# EAGLE schematic W952 (EAGLE 6.6.0)
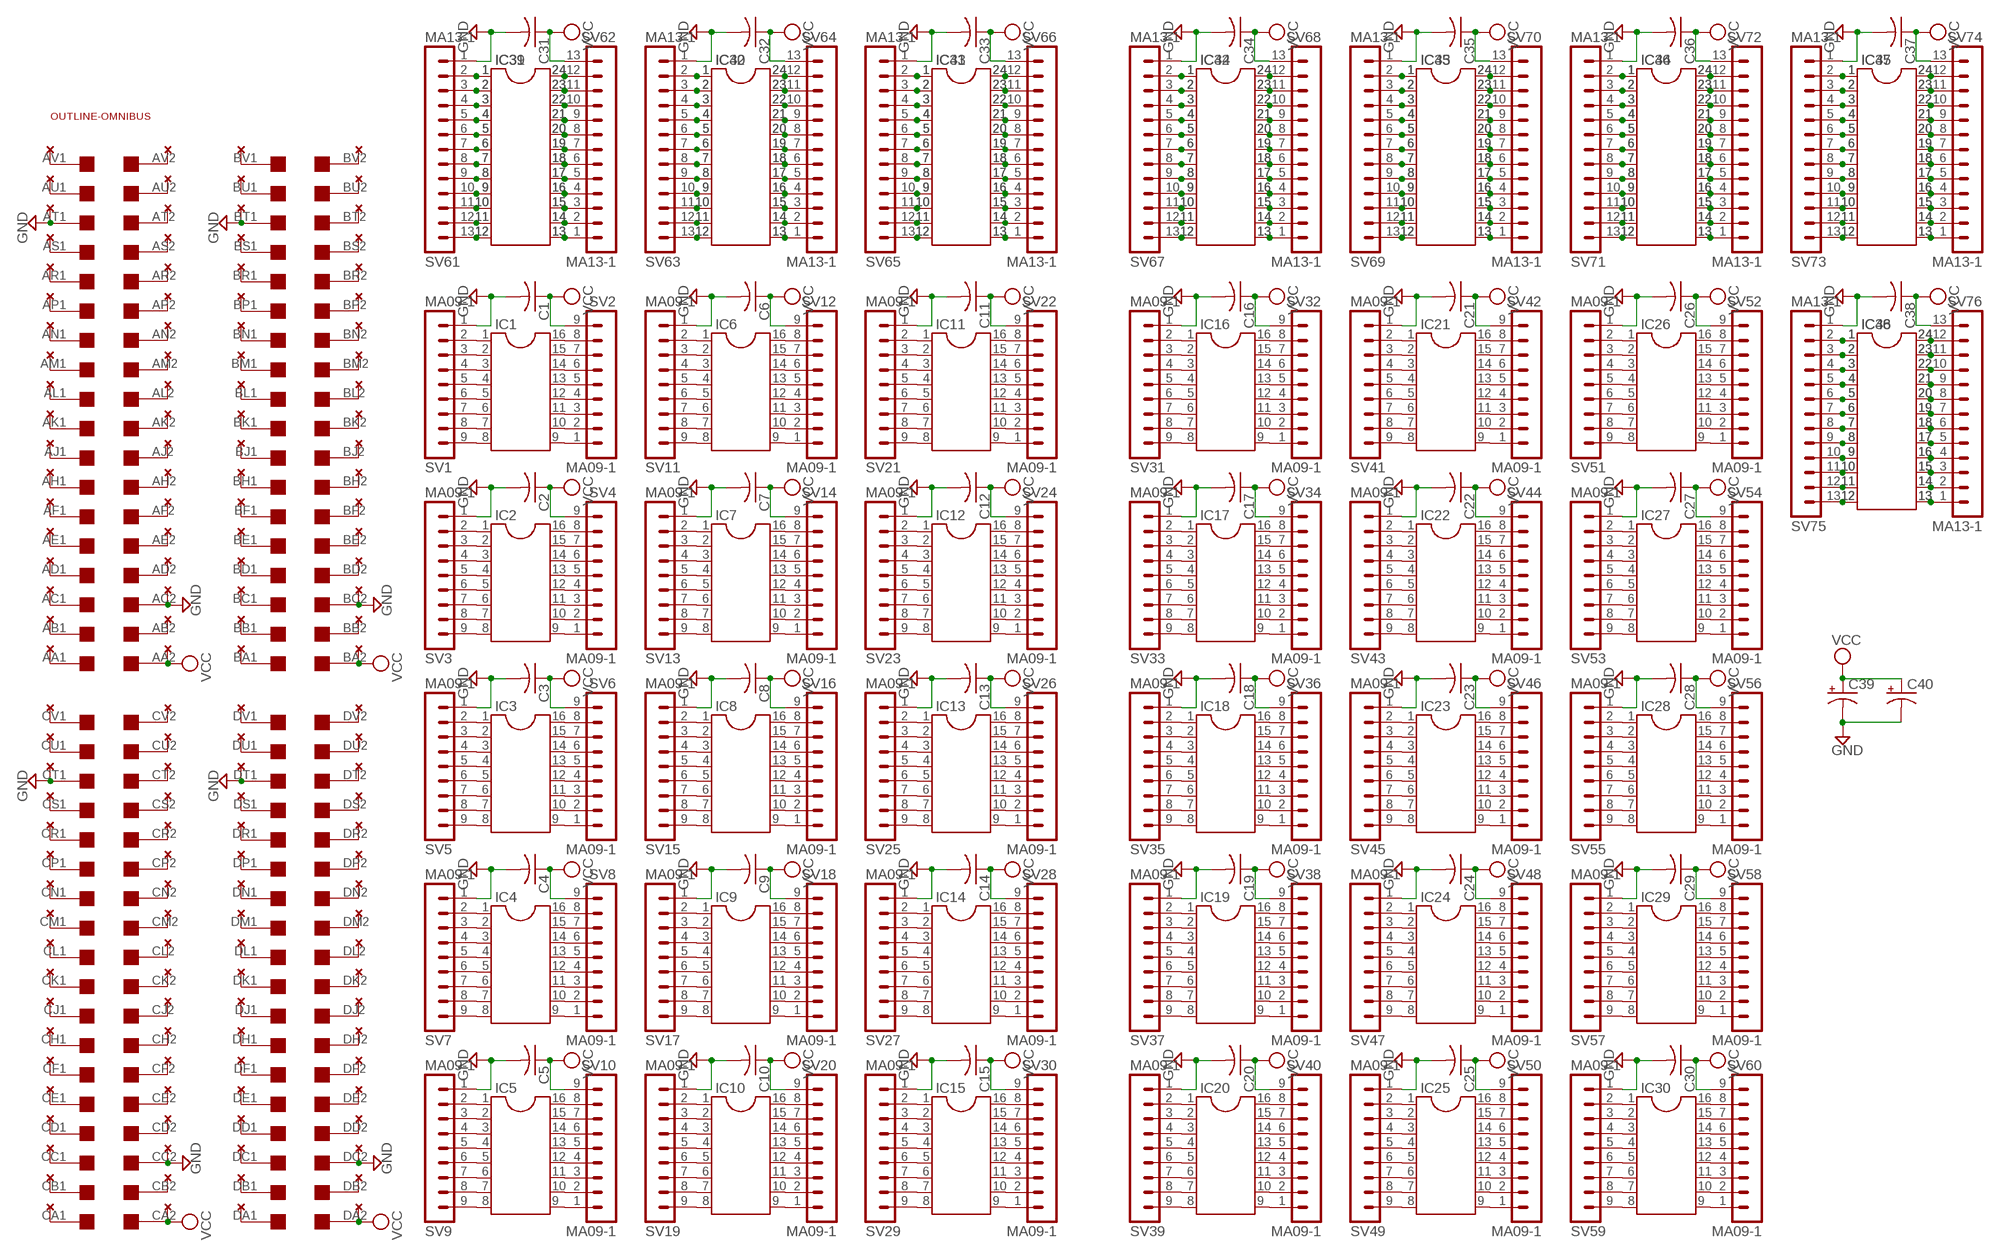
[diagram p0: schematic, sheet 1]

## Parts
C1  C-US075-032X103  [C075-032X103]
C2  C-US075-032X103  [C075-032X103]
C3  C-US075-032X103  [C075-032X103]
C4  C-US075-032X103  [C075-032X103]
C5  C-US075-032X103  [C075-032X103]
C6  C-US075-032X103  [C075-032X103]
C7  C-US075-032X103  [C075-032X103]
C8  C-US075-032X103  [C075-032X103]
C9  C-US075-032X103  [C075-032X103]
C10  C-US075-032X103  [C075-032X103]
C11  C-US075-032X103  [C075-032X103]
C12  C-US075-032X103  [C075-032X103]
C13  C-US075-032X103  [C075-032X103]
C14  C-US075-032X103  [C075-032X103]
C15  C-US075-032X103  [C075-032X103]
C16  C-US075-032X103  [C075-032X103]
C17  C-US075-032X103  [C075-032X103]
C18  C-US075-032X103  [C075-032X103]
C19  C-US075-032X103  [C075-032X103]
C20  C-US075-032X103  [C075-032X103]
C21  C-US075-032X103  [C075-032X103]
C22  C-US075-032X103  [C075-032X103]
C23  C-US075-032X103  [C075-032X103]
C24  C-US075-032X103  [C075-032X103]
C25  C-US075-032X103  [C075-032X103]
C26  C-US075-032X103  [C075-032X103]
C27  C-US075-032X103  [C075-032X103]
C28  C-US075-032X103  [C075-032X103]
C29  C-US075-032X103  [C075-032X103]
C30  C-US075-032X103  [C075-032X103]
C31  C-US075-032X103  [C075-032X103]
C32  C-US075-032X103  [C075-032X103]
C33  C-US075-032X103  [C075-032X103]
C34  C-US075-032X103  [C075-032X103]
C35  C-US075-032X103  [C075-032X103]
C36  C-US075-032X103  [C075-032X103]
C37  C-US075-032X103  [C075-032X103]
C38  C-US075-032X103  [C075-032X103]
C39  CPOL-USE15-5AXIAL  [E15-5]
C40  CPOL-USE15-5AXIAL  [E15-5]
IC1  DIL16S  [SOCKET-16]
IC2  DIL16S  [SOCKET-16]
IC3  DIL16S  [SOCKET-16]
IC4  DIL16S  [SOCKET-16]
IC5  DIL16S  [SOCKET-16]
IC6  DIL16S  [SOCKET-16]
IC7  DIL16S  [SOCKET-16]
IC8  DIL16S  [SOCKET-16]
IC9  DIL16S  [SOCKET-16]
IC10  DIL16S  [SOCKET-16]
IC11  DIL16S  [SOCKET-16]
IC12  DIL16S  [SOCKET-16]
IC13  DIL16S  [SOCKET-16]
IC14  DIL16S  [SOCKET-16]
IC15  DIL16S  [SOCKET-16]
IC16  DIL16S  [SOCKET-16]
IC17  DIL16S  [SOCKET-16]
IC18  DIL16S  [SOCKET-16]
IC19  DIL16S  [SOCKET-16]
IC20  DIL16S  [SOCKET-16]
IC21  DIL16S  [SOCKET-16]
IC22  DIL16S  [SOCKET-16]
IC23  DIL16S  [SOCKET-16]
IC24  DIL16S  [SOCKET-16]
IC25  DIL16S  [SOCKET-16]
IC26  DIL16S  [SOCKET-16]
IC27  DIL16S  [SOCKET-16]
IC28  DIL16S  [SOCKET-16]
IC29  DIL16S  [SOCKET-16]
IC30  DIL16S  [SOCKET-16]
IC31  DIL24-6  [DIL24-6]
IC32  DIL24-6  [DIL24-6]
IC33  DIL24-6  [DIL24-6]
IC34  DIL24-6  [DIL24-6]
IC35  DIL24-6  [DIL24-6]
IC36  DIL24-6  [DIL24-6]
IC37  DIL24-6  [DIL24-6]
IC38  DIL24-6  [DIL24-6]
IC39  DIL24-3  [DIL24-3]
IC40  DIL24-3  [DIL24-3]
IC41  DIL24-3  [DIL24-3]
IC42  DIL24-3  [DIL24-3]
IC43  DIL24-3  [DIL24-3]
IC44  DIL24-3  [DIL24-3]
IC45  DIL24-3  [DIL24-3]
IC46  DIL24-3  [DIL24-3]
SV1  MA09-1  [MA09-1]
SV2  MA09-1  [MA09-1]
SV3  MA09-1  [MA09-1]
SV4  MA09-1  [MA09-1]
SV5  MA09-1  [MA09-1]
SV6  MA09-1  [MA09-1]
SV7  MA09-1  [MA09-1]
SV8  MA09-1  [MA09-1]
SV9  MA09-1  [MA09-1]
SV10  MA09-1  [MA09-1]
SV11  MA09-1  [MA09-1]
SV12  MA09-1  [MA09-1]
SV13  MA09-1  [MA09-1]
SV14  MA09-1  [MA09-1]
SV15  MA09-1  [MA09-1]
SV16  MA09-1  [MA09-1]
SV17  MA09-1  [MA09-1]
SV18  MA09-1  [MA09-1]
SV19  MA09-1  [MA09-1]
SV20  MA09-1  [MA09-1]
SV21  MA09-1  [MA09-1]
SV22  MA09-1  [MA09-1]
SV23  MA09-1  [MA09-1]
SV24  MA09-1  [MA09-1]
SV25  MA09-1  [MA09-1]
SV26  MA09-1  [MA09-1]
SV27  MA09-1  [MA09-1]
SV28  MA09-1  [MA09-1]
SV29  MA09-1  [MA09-1]
SV30  MA09-1  [MA09-1]
SV31  MA09-1  [MA09-1]
SV32  MA09-1  [MA09-1]
SV33  MA09-1  [MA09-1]
SV34  MA09-1  [MA09-1]
SV35  MA09-1  [MA09-1]
SV36  MA09-1  [MA09-1]
SV37  MA09-1  [MA09-1]
SV38  MA09-1  [MA09-1]
SV39  MA09-1  [MA09-1]
SV40  MA09-1  [MA09-1]
SV41  MA09-1  [MA09-1]
SV42  MA09-1  [MA09-1]
SV43  MA09-1  [MA09-1]
SV44  MA09-1  [MA09-1]
SV45  MA09-1  [MA09-1]
SV46  MA09-1  [MA09-1]
SV47  MA09-1  [MA09-1]
SV48  MA09-1  [MA09-1]
SV49  MA09-1  [MA09-1]
SV50  MA09-1  [MA09-1]
SV51  MA09-1  [MA09-1]
SV52  MA09-1  [MA09-1]
SV53  MA09-1  [MA09-1]
SV54  MA09-1  [MA09-1]
SV55  MA09-1  [MA09-1]
SV56  MA09-1  [MA09-1]
SV57  MA09-1  [MA09-1]
SV58  MA09-1  [MA09-1]
SV59  MA09-1  [MA09-1]
SV60  MA09-1  [MA09-1]
SV61  MA13-1  [MA13-1]
SV62  MA13-1  [MA13-1]
SV63  MA13-1  [MA13-1]
SV64  MA13-1  [MA13-1]
SV65  MA13-1  [MA13-1]
SV66  MA13-1  [MA13-1]
SV67  MA13-1  [MA13-1]
SV68  MA13-1  [MA13-1]
SV69  MA13-1  [MA13-1]
SV70  MA13-1  [MA13-1]
SV71  MA13-1  [MA13-1]
SV72  MA13-1  [MA13-1]
SV73  MA13-1  [MA13-1]
SV74  MA13-1  [MA13-1]
SV75  MA13-1  [MA13-1]
SV76  MA13-1  [MA13-1]
U$1  QUAD  [EDGE-CON8]
U$2  THRU-HOLE2W  [THRU-HOLE2]
U$3  THRU-HOLE2W  [THRU-HOLE2]
U$4  THRU-HOLE2W  [THRU-HOLE2]
U$5  THRU-HOLE2W  [THRU-HOLE2]
U$8  OUTLINE-OMNIBUS  [OMNIBUS]

## Nets
GND [supply]: C1.2 C2.2 C3.2 C4.2 C5.2 C6.2 C7.2 C8.2 C9.2 C10.2 C11.2 C12.2 C13.2 C14.2 C15.2 C16.2 C17.2 C18.2 C19.2 C20.2 C21.2 C22.2 C23.2 C24.2 C25.2 C26.2 C27.2 C28.2 C29.2 C30.2 C31.2 C32.2 C33.2 C34.2 C35.2 C36.2 C37.2 C38.2 C39.- C40.- SV1.1 SV3.1 SV5.1 SV7.1 SV9.1 SV11.1 SV13.1 SV15.1 SV17.1 SV19.1 SV21.1 SV23.1 SV25.1 SV27.1 SV29.1 SV31.1 SV33.1 SV35.1 SV37.1 SV39.1 SV41.1 SV43.1 SV45.1 SV47.1 SV49.1 SV51.1 SV53.1 SV55.1 SV57.1 SV59.1 SV61.1 SV63.1 SV65.1 SV67.1 SV69.1 SV71.1 SV73.1 SV75.1 U$1.AC2 U$1.AT1 U$1.BC2 U$1.BT1 U$1.CC2 U$1.CT1 U$1.DC2 U$1.DT1 U$2.C1 U$2.T2 U$3.C1 U$3.T2 U$4.C1 U$4.T2 U$5.C1 U$5.T2
N$1: U$1.AK1 U$2.K2
N$2: U$1.AJ1 U$2.J2
N$3: U$1.AH1 U$2.H2
N$4: U$1.AL1 U$2.L2
N$5: U$1.AM1 U$2.M2
N$6: U$1.AN1 U$2.N2
N$7: U$1.AP1 U$2.P2
N$8: U$1.AF1 U$2.F2
N$9: U$1.AE1 U$2.E2
N$10: U$1.AD1 U$2.D2
N$11: U$1.AC1 U$2.C2
N$12: U$1.AR1 U$2.R2
N$13: U$1.AS1 U$2.S2
N$14: U$1.AB1 U$2.B2
N$15: U$1.AA1 U$2.A2
N$16: U$1.AU1 U$2.U2
N$17: U$1.AV1 U$2.V2
N$18: U$1.AV2 U$2.V1
N$19: U$1.AU2 U$2.U1
N$20: U$1.AT2 U$2.T1
N$21: U$1.AS2 U$2.S1
N$22: U$1.AR2 U$2.R1
N$23: U$1.AP2 U$2.P1
N$24: U$1.AN2 U$2.N1
N$25: U$1.AM2 U$2.M1
N$26: U$1.AL2 U$2.L1
N$27: U$1.AK2 U$2.K1
N$28: U$1.AJ2 U$2.J1
N$29: U$1.AH2 U$2.H1
N$30: U$1.AF2 U$2.F1
N$31: U$1.AE2 U$2.E1
N$32: U$1.AD2 U$2.D1
N$33: U$1.AB2 U$2.B1
N$34: U$1.BV1 U$3.V2
N$35: U$1.BU1 U$3.U2
N$36: U$1.BS1 U$3.S2
N$37: U$1.BR1 U$3.R2
N$38: U$1.BP1 U$3.P2
N$39: U$1.BN1 U$3.N2
N$40: U$1.BM1 U$3.M2
N$41: U$1.BL1 U$3.L2
N$42: U$1.BK1 U$3.K2
N$43: U$1.BJ1 U$3.J2
N$44: U$1.BH1 U$3.H2
N$45: U$1.BF1 U$3.F2
N$46: U$1.BE1 U$3.E2
N$47: U$1.BD1 U$3.D2
N$48: U$1.BC1 U$3.C2
N$49: U$1.BB1 U$3.B2
N$50: U$1.BA1 U$3.A2
N$51: U$1.BV2 U$3.V1
N$52: U$1.BU2 U$3.U1
N$53: U$1.BT2 U$3.T1
N$54: U$1.BS2 U$3.S1
N$55: U$1.BR2 U$3.R1
N$56: U$1.BP2 U$3.P1
N$57: U$1.BN2 U$3.N1
N$58: U$1.BM2 U$3.M1
N$59: U$1.BL2 U$3.L1
N$60: U$1.BK2 U$3.K1
N$61: U$1.BJ2 U$3.J1
N$62: U$1.BH2 U$3.H1
N$63: U$1.BF2 U$3.F1
N$64: U$1.BE2 U$3.E1
N$65: U$1.BD2 U$3.D1
N$66: U$1.BB2 U$3.B1
N$67: U$1.CV1 U$4.V2
N$68: U$1.CU1 U$4.U2
N$69: U$1.CS1 U$4.S2
N$70: U$1.CR1 U$4.R2
N$71: U$1.CP1 U$4.P2
N$72: U$1.CN1 U$4.N2
N$73: U$1.CM1 U$4.M2
N$74: U$1.CL1 U$4.L2
N$75: U$1.CK1 U$4.K2
N$76: U$1.CJ1 U$4.J2
N$77: U$1.CH1 U$4.H2
N$78: U$1.CF1 U$4.F2
N$79: U$1.CE1 U$4.E2
N$80: U$1.CD1 U$4.D2
N$81: U$1.CC1 U$4.C2
N$82: U$1.CB1 U$4.B2
N$83: U$1.CA1 U$4.A2
N$84: U$1.CV2 U$4.V1
N$85: U$1.CU2 U$4.U1
N$86: U$1.CT2 U$4.T1
N$87: U$1.CS2 U$4.S1
N$88: U$1.CR2 U$4.R1
N$89: U$1.CP2 U$4.P1
N$90: U$1.CN2 U$4.N1
N$91: U$1.CM2 U$4.M1
N$92: U$1.CL2 U$4.L1
N$93: U$1.CK2 U$4.K1
N$94: U$1.CJ2 U$4.J1
N$95: U$1.CH2 U$4.H1
N$96: U$1.CF2 U$4.F1
N$97: U$1.CE2 U$4.E1
N$98: U$1.CD2 U$4.D1
N$99: U$1.CB2 U$4.B1
N$100: U$1.DV1 U$5.V2
N$101: U$1.DU1 U$5.U2
N$102: U$1.DS1 U$5.S2
N$103: U$1.DR1 U$5.R2
N$104: U$1.DP1 U$5.P2
N$105: U$1.DN1 U$5.N2
N$106: U$1.DM1 U$5.M2
N$107: U$1.DL1 U$5.L2
N$108: U$1.DK1 U$5.K2
N$109: U$1.DJ1 U$5.J2
N$110: U$1.DH1 U$5.H2
N$111: U$1.DF1 U$5.F2
N$112: U$1.DE1 U$5.E2
N$113: U$1.DD1 U$5.D2
N$114: U$1.DC1 U$5.C2
N$115: U$1.DB1 U$5.B2
N$116: U$1.DA1 U$5.A2
N$117: U$1.DV2 U$5.V1
N$118: U$1.DU2 U$5.U1
N$119: U$1.DT2 U$5.T1
N$120: U$1.DS2 U$5.S1
N$121: U$1.DR2 U$5.R1
N$122: U$1.DP2 U$5.P1
N$123: U$1.DN2 U$5.N1
N$124: U$1.DM2 U$5.M1
N$125: U$1.DL2 U$5.L1
N$126: U$1.DK2 U$5.K1
N$127: U$1.DJ2 U$5.J1
N$128: U$1.DH2 U$5.H1
N$129: U$1.DF2 U$5.F1
N$130: U$1.DE2 U$5.E1
N$131: U$1.DD2 U$5.D1
N$132: U$1.DB2 U$5.B1
N$133: IC1.1 SV1.2
N$134: IC1.2 SV1.3
N$135: IC1.3 SV1.4
N$136: IC1.4 SV1.5
N$137: IC1.5 SV1.6
N$138: IC1.6 SV1.7
N$139: IC1.7 SV1.8
N$140: IC1.8 SV1.9
N$141: IC1.9 SV2.1
N$142: IC1.10 SV2.2
N$143: IC1.11 SV2.3
N$144: IC1.12 SV2.4
N$145: IC1.13 SV2.5
N$146: IC1.14 SV2.6
N$147: IC1.15 SV2.7
N$148: IC1.16 SV2.8
N$151: IC2.1 SV3.2
N$152: IC2.2 SV3.3
N$153: IC2.3 SV3.4
N$154: IC2.4 SV3.5
N$155: IC2.5 SV3.6
N$156: IC2.6 SV3.7
N$157: IC2.7 SV3.8
N$158: IC2.8 SV3.9
N$159: IC2.9 SV4.1
N$160: IC2.10 SV4.2
N$161: IC2.11 SV4.3
N$162: IC2.12 SV4.4
N$163: IC2.13 SV4.5
N$164: IC2.14 SV4.6
N$165: IC2.15 SV4.7
N$166: IC2.16 SV4.8
N$169: IC3.1 SV5.2
N$170: IC3.2 SV5.3
N$171: IC3.3 SV5.4
N$172: IC3.4 SV5.5
N$173: IC3.5 SV5.6
N$174: IC3.6 SV5.7
N$175: IC3.7 SV5.8
N$176: IC3.8 SV5.9
N$177: IC3.9 SV6.1
N$178: IC3.10 SV6.2
N$179: IC3.11 SV6.3
N$180: IC3.12 SV6.4
N$181: IC3.13 SV6.5
N$182: IC3.14 SV6.6
N$183: IC3.15 SV6.7
N$184: IC3.16 SV6.8
N$187: IC4.1 SV7.2
N$188: IC4.2 SV7.3
N$189: IC4.3 SV7.4
N$190: IC4.4 SV7.5
N$191: IC4.5 SV7.6
N$192: IC4.6 SV7.7
N$193: IC4.7 SV7.8
N$194: IC4.8 SV7.9
N$195: IC4.9 SV8.1
N$196: IC4.10 SV8.2
N$197: IC4.11 SV8.3
N$198: IC4.12 SV8.4
N$199: IC4.13 SV8.5
N$200: IC4.14 SV8.6
N$201: IC4.15 SV8.7
N$202: IC4.16 SV8.8
N$205: IC5.1 SV9.2
N$206: IC5.2 SV9.3
N$207: IC5.3 SV9.4
N$208: IC5.4 SV9.5
N$209: IC5.5 SV9.6
N$210: IC5.6 SV9.7
N$211: IC5.7 SV9.8
N$212: IC5.8 SV9.9
N$213: IC5.9 SV10.1
N$214: IC5.10 SV10.2
N$215: IC5.11 SV10.3
N$216: IC5.12 SV10.4
N$217: IC5.13 SV10.5
N$218: IC5.14 SV10.6
N$219: IC5.15 SV10.7
N$220: IC5.16 SV10.8
N$223: IC6.1 SV11.2
N$224: IC6.2 SV11.3
N$225: IC6.3 SV11.4
N$226: IC6.4 SV11.5
N$227: IC6.5 SV11.6
N$228: IC6.6 SV11.7
N$229: IC6.7 SV11.8
N$230: IC6.8 SV11.9
N$231: IC6.9 SV12.1
N$232: IC6.10 SV12.2
N$233: IC6.11 SV12.3
N$234: IC6.12 SV12.4
N$235: IC6.13 SV12.5
N$236: IC6.14 SV12.6
N$237: IC6.15 SV12.7
N$238: IC6.16 SV12.8
N$241: IC7.1 SV13.2
N$242: IC7.2 SV13.3
N$243: IC7.3 SV13.4
N$244: IC7.4 SV13.5
N$245: IC7.5 SV13.6
N$246: IC7.6 SV13.7
N$247: IC7.7 SV13.8
N$248: IC7.8 SV13.9
N$249: IC7.9 SV14.1
N$250: IC7.10 SV14.2
N$251: IC7.11 SV14.3
N$252: IC7.12 SV14.4
N$253: IC7.13 SV14.5
N$254: IC7.14 SV14.6
N$255: IC7.15 SV14.7
N$256: IC7.16 SV14.8
N$259: IC8.1 SV15.2
N$260: IC8.2 SV15.3
N$261: IC8.3 SV15.4
N$262: IC8.4 SV15.5
N$263: IC8.5 SV15.6
N$264: IC8.6 SV15.7
N$265: IC8.7 SV15.8
N$266: IC8.8 SV15.9
N$267: IC8.9 SV16.1
N$268: IC8.10 SV16.2
N$269: IC8.11 SV16.3
N$270: IC8.12 SV16.4
N$271: IC8.13 SV16.5
N$272: IC8.14 SV16.6
N$273: IC8.15 SV16.7
N$274: IC8.16 SV16.8
N$277: IC9.1 SV17.2
N$278: IC9.2 SV17.3
N$279: IC9.3 SV17.4
N$280: IC9.4 SV17.5
N$281: IC9.5 SV17.6
N$282: IC9.6 SV17.7
N$283: IC9.7 SV17.8
N$284: IC9.8 SV17.9
N$285: IC9.9 SV18.1
N$286: IC9.10 SV18.2
N$287: IC9.11 SV18.3
N$288: IC9.12 SV18.4
N$289: IC9.13 SV18.5
N$290: IC9.14 SV18.6
N$291: IC9.15 SV18.7
N$292: IC9.16 SV18.8
N$295: IC10.1 SV19.2
N$296: IC10.2 SV19.3
N$297: IC10.3 SV19.4
N$298: IC10.4 SV19.5
N$299: IC10.5 SV19.6
N$300: IC10.6 SV19.7
N$301: IC10.7 SV19.8
N$302: IC10.8 SV19.9
N$303: IC10.9 SV20.1
N$304: IC10.10 SV20.2
N$305: IC10.11 SV20.3
N$306: IC10.12 SV20.4
N$307: IC10.13 SV20.5
N$308: IC10.14 SV20.6
N$309: IC10.15 SV20.7
N$310: IC10.16 SV20.8
N$313: IC11.1 SV21.2
N$314: IC11.2 SV21.3
N$315: IC11.3 SV21.4
N$316: IC11.4 SV21.5
N$317: IC11.5 SV21.6
N$318: IC11.6 SV21.7
N$319: IC11.7 SV21.8
N$320: IC11.8 SV21.9
N$321: IC11.9 SV22.1
N$322: IC11.10 SV22.2
N$323: IC11.11 SV22.3
N$324: IC11.12 SV22.4
N$325: IC11.13 SV22.5
N$326: IC11.14 SV22.6
N$327: IC11.15 SV22.7
N$328: IC11.16 SV22.8
N$331: IC12.1 SV23.2
N$332: IC12.2 SV23.3
N$333: IC12.3 SV23.4
N$334: IC12.4 SV23.5
N$335: IC12.5 SV23.6
N$336: IC12.6 SV23.7
N$337: IC12.7 SV23.8
N$338: IC12.8 SV23.9
N$339: IC12.9 SV24.1
N$340: IC12.10 SV24.2
N$341: IC12.11 SV24.3
N$342: IC12.12 SV24.4
N$343: IC12.13 SV24.5
N$344: IC12.14 SV24.6
N$345: IC12.15 SV24.7
N$346: IC12.16 SV24.8
N$349: IC13.1 SV25.2
N$350: IC13.2 SV25.3
N$351: IC13.3 SV25.4
N$352: IC13.4 SV25.5
N$353: IC13.5 SV25.6
N$354: IC13.6 SV25.7
N$355: IC13.7 SV25.8
N$356: IC13.8 SV25.9
N$357: IC13.9 SV26.1
N$358: IC13.10 SV26.2
N$359: IC13.11 SV26.3
N$360: IC13.12 SV26.4
N$361: IC13.13 SV26.5
N$362: IC13.14 SV26.6
N$363: IC13.15 SV26.7
N$364: IC13.16 SV26.8
N$367: IC14.1 SV27.2
N$368: IC14.2 SV27.3
N$369: IC14.3 SV27.4
N$370: IC14.4 SV27.5
N$371: IC14.5 SV27.6
N$372: IC14.6 SV27.7
N$373: IC14.7 SV27.8
N$374: IC14.8 SV27.9
N$375: IC14.9 SV28.1
N$376: IC14.10 SV28.2
N$377: IC14.11 SV28.3
N$378: IC14.12 SV28.4
N$379: IC14.13 SV28.5
N$380: IC14.14 SV28.6
N$381: IC14.15 SV28.7
N$382: IC14.16 SV28.8
N$385: IC15.1 SV29.2
N$386: IC15.2 SV29.3
N$387: IC15.3 SV29.4
N$388: IC15.4 SV29.5
N$389: IC15.5 SV29.6
N$390: IC15.6 SV29.7
N$391: IC15.7 SV29.8
N$392: IC15.8 SV29.9
N$393: IC15.9 SV30.1
N$394: IC15.10 SV30.2
N$395: IC15.11 SV30.3
N$396: IC15.12 SV30.4
N$397: IC15.13 SV30.5
N$398: IC15.14 SV30.6
N$399: IC15.15 SV30.7
N$400: IC15.16 SV30.8
N$403: IC16.1 SV31.2
N$404: IC16.2 SV31.3
N$405: IC16.3 SV31.4
N$406: IC16.4 SV31.5
N$407: IC16.5 SV31.6
N$408: IC16.6 SV31.7
N$409: IC16.7 SV31.8
N$410: IC16.8 SV31.9
N$411: IC16.9 SV32.1
N$412: IC16.10 SV32.2
N$413: IC16.11 SV32.3
N$414: IC16.12 SV32.4
N$415: IC16.13 SV32.5
N$416: IC16.14 SV32.6
N$417: IC16.15 SV32.7
N$418: IC16.16 SV32.8
N$421: IC17.1 SV33.2
N$422: IC17.2 SV33.3
N$423: IC17.3 SV33.4
N$424: IC17.4 SV33.5
N$425: IC17.5 SV33.6
N$426: IC17.6 SV33.7
N$427: IC17.7 SV33.8
N$428: IC17.8 SV33.9
N$429: IC17.9 SV34.1
N$430: IC17.10 SV34.2
N$431: IC17.11 SV34.3
N$432: IC17.12 SV34.4
N$433: IC17.13 SV34.5
N$434: IC17.14 SV34.6
N$435: IC17.15 SV34.7
N$436: IC17.16 SV34.8
N$439: IC18.1 SV35.2
N$440: IC18.2 SV35.3
N$441: IC18.3 SV35.4
N$442: IC18.4 SV35.5
N$443: IC18.5 SV35.6
N$444: IC18.6 SV35.7
N$445: IC18.7 SV35.8
N$446: IC18.8 SV35.9
N$447: IC18.9 SV36.1
N$448: IC18.10 SV36.2
N$449: IC18.11 SV36.3
N$450: IC18.12 SV36.4
N$451: IC18.13 SV36.5
N$452: IC18.14 SV36.6
N$453: IC18.15 SV36.7
N$454: IC18.16 SV36.8
N$457: IC19.1 SV37.2
N$458: IC19.2 SV37.3
N$459: IC19.3 SV37.4
N$460: IC19.4 SV37.5
N$461: IC19.5 SV37.6
N$462: IC19.6 SV37.7
N$463: IC19.7 SV37.8
N$464: IC19.8 SV37.9
N$465: IC19.9 SV38.1
N$466: IC19.10 SV38.2
N$467: IC19.11 SV38.3
N$468: IC19.12 SV38.4
N$469: IC19.13 SV38.5
N$470: IC19.14 SV38.6
N$471: IC19.15 SV38.7
N$472: IC19.16 SV38.8
N$475: IC20.1 SV39.2
N$476: IC20.2 SV39.3
N$477: IC20.3 SV39.4
N$478: IC20.4 SV39.5
N$479: IC20.5 SV39.6
N$480: IC20.6 SV39.7
N$481: IC20.7 SV39.8
N$482: IC20.8 SV39.9
N$483: IC20.9 SV40.1
N$484: IC20.10 SV40.2
N$485: IC20.11 SV40.3
N$486: IC20.12 SV40.4
N$487: IC20.13 SV40.5
N$488: IC20.14 SV40.6
N$489: IC20.15 SV40.7
N$490: IC20.16 SV40.8
N$493: IC21.1 SV41.2
N$494: IC21.2 SV41.3
N$495: IC21.3 SV41.4
N$496: IC21.4 SV41.5
N$497: IC21.5 SV41.6
N$498: IC21.6 SV41.7
N$499: IC21.7 SV41.8
N$500: IC21.8 SV41.9
N$501: IC21.9 SV42.1
N$502: IC21.10 SV42.2
N$503: IC21.11 SV42.3
N$504: IC21.12 SV42.4
N$505: IC21.13 SV42.5
N$506: IC21.14 SV42.6
N$507: IC21.15 SV42.7
N$508: IC21.16 SV42.8
N$511: IC22.1 SV43.2
N$512: IC22.2 SV43.3
N$513: IC22.3 SV43.4
N$514: IC22.4 SV43.5
N$515: IC22.5 SV43.6
N$516: IC22.6 SV43.7
N$517: IC22.7 SV43.8
N$518: IC22.8 SV43.9
N$519: IC22.9 SV44.1
N$520: IC22.10 SV44.2
N$521: IC22.11 SV44.3
N$522: IC22.12 SV44.4
N$523: IC22.13 SV44.5
N$524: IC22.14 SV44.6
N$525: IC22.15 SV44.7
N$526: IC22.16 SV44.8
N$529: IC23.1 SV45.2
N$530: IC23.2 SV45.3
N$531: IC23.3 SV45.4
N$532: IC23.4 SV45.5
N$533: IC23.5 SV45.6
N$534: IC23.6 SV45.7
N$535: IC23.7 SV45.8
N$536: IC23.8 SV45.9
N$537: IC23.9 SV46.1
N$538: IC23.10 SV46.2
N$539: IC23.11 SV46.3
N$540: IC23.12 SV46.4
N$541: IC23.13 SV46.5
N$542: IC23.14 SV46.6
N$543: IC23.15 SV46.7
N$544: IC23.16 SV46.8
N$547: IC24.1 SV47.2
N$548: IC24.2 SV47.3
N$549: IC24.3 SV47.4
N$550: IC24.4 SV47.5
N$551: IC24.5 SV47.6
N$552: IC24.6 SV47.7
N$553: IC24.7 SV47.8
N$554: IC24.8 SV47.9
N$555: IC24.9 SV48.1
N$556: IC24.10 SV48.2
N$557: IC24.11 SV48.3
N$558: IC24.12 SV48.4
N$559: IC24.13 SV48.5
N$560: IC24.14 SV48.6
N$561: IC24.15 SV48.7
N$562: IC24.16 SV48.8
N$565: IC25.1 SV49.2
N$566: IC25.2 SV49.3
N$567: IC25.3 SV49.4
N$568: IC25.4 SV49.5
N$569: IC25.5 SV49.6
N$570: IC25.6 SV49.7
N$571: IC25.7 SV49.8
N$572: IC25.8 SV49.9
N$573: IC25.9 SV50.1
N$574: IC25.10 SV50.2
N$575: IC25.11 SV50.3
N$576: IC25.12 SV50.4
N$577: IC25.13 SV50.5
N$578: IC25.14 SV50.6
N$579: IC25.15 SV50.7
N$580: IC25.16 SV50.8
N$583: IC26.1 SV51.2
N$584: IC26.2 SV51.3
N$585: IC26.3 SV51.4
N$586: IC26.4 SV51.5
N$587: IC26.5 SV51.6
N$588: IC26.6 SV51.7
N$589: IC26.7 SV51.8
N$590: IC26.8 SV51.9
N$591: IC26.9 SV52.1
N$592: IC26.10 SV52.2
N$593: IC26.11 SV52.3
N$594: IC26.12 SV52.4
N$595: IC26.13 SV52.5
N$596: IC26.14 SV52.6
N$597: IC26.15 SV52.7
N$598: IC26.16 SV52.8
N$601: IC27.1 SV53.2
N$602: IC27.2 SV53.3
N$603: IC27.3 SV53.4
N$604: IC27.4 SV53.5
N$605: IC27.5 SV53.6
N$606: IC27.6 SV53.7
N$607: IC27.7 SV53.8
N$608: IC27.8 SV53.9
N$609: IC27.9 SV54.1
N$610: IC27.10 SV54.2
N$611: IC27.11 SV54.3
N$612: IC27.12 SV54.4
N$613: IC27.13 SV54.5
N$614: IC27.14 SV54.6
N$615: IC27.15 SV54.7
N$616: IC27.16 SV54.8
N$619: IC28.1 SV55.2
N$620: IC28.2 SV55.3
N$621: IC28.3 SV55.4
N$622: IC28.4 SV55.5
N$623: IC28.5 SV55.6
N$624: IC28.6 SV55.7
N$625: IC28.7 SV55.8
N$626: IC28.8 SV55.9
N$627: IC28.9 SV56.1
N$628: IC28.10 SV56.2
N$629: IC28.11 SV56.3
N$630: IC28.12 SV56.4
N$631: IC28.13 SV56.5
N$632: IC28.14 SV56.6
N$633: IC28.15 SV56.7
N$634: IC28.16 SV56.8
N$637: IC29.1 SV57.2
N$638: IC29.2 SV57.3
N$639: IC29.3 SV57.4
N$640: IC29.4 SV57.5
N$641: IC29.5 SV57.6
N$642: IC29.6 SV57.7
N$643: IC29.7 SV57.8
N$644: IC29.8 SV57.9
N$645: IC29.9 SV58.1
N$646: IC29.10 SV58.2
N$647: IC29.11 SV58.3
N$648: IC29.12 SV58.4
N$649: IC29.13 SV58.5
N$650: IC29.14 SV58.6
N$651: IC29.15 SV58.7
N$652: IC29.16 SV58.8
N$655: IC30.1 SV59.2
N$656: IC30.2 SV59.3
N$657: IC30.3 SV59.4
N$658: IC30.4 SV59.5
N$659: IC30.5 SV59.6
N$660: IC30.6 SV59.7
N$661: IC30.7 SV59.8
N$662: IC30.8 SV59.9
N$663: IC30.9 SV60.1
N$664: IC30.10 SV60.2
N$665: IC30.11 SV60.3
N$666: IC30.12 SV60.4
N$667: IC30.13 SV60.5
N$668: IC30.14 SV60.6
N$669: IC30.15 SV60.7
N$670: IC30.16 SV60.8
N$673: IC31.1 IC39.1 SV61.2
N$674: IC31.2 IC39.2 SV61.3
N$675: IC31.3 IC39.3 SV61.4
N$676: IC31.4 IC39.4 SV61.5
N$677: IC31.5 IC39.5 SV61.6
N$678: IC31.6 IC39.6 SV61.7
N$679: IC31.7 IC39.7 SV61.8
N$680: IC31.8 IC39.8 SV61.9
N$681: IC31.9 IC39.9 SV61.10
N$682: IC31.10 IC39.10 SV61.11
N$683: IC31.11 IC39.11 SV61.12
N$684: IC31.12 IC39.12 SV61.13
N$685: IC31.13 IC39.13 SV62.1
N$686: IC31.14 IC39.14 SV62.2
N$687: IC31.15 IC39.15 SV62.3
N$688: IC31.16 IC39.16 SV62.4
N$689: IC31.17 IC39.17 SV62.5
N$690: IC31.18 IC39.18 SV62.6
N$691: IC31.19 IC39.19 SV62.7
N$692: IC31.20 IC39.20 SV62.8
N$693: IC31.21 IC39.21 SV62.9
N$694: IC31.22 IC39.22 SV62.10
N$695: IC31.23 IC39.23 SV62.11
N$696: IC31.24 IC39.24 SV62.12
N$699: IC32.1 IC40.1 SV63.2
N$700: IC32.2 IC40.2 SV63.3
N$701: IC32.3 IC40.3 SV63.4
N$702: IC32.4 IC40.4 SV63.5
N$703: IC32.5 IC40.5 SV63.6
N$704: IC32.6 IC40.6 SV63.7
N$705: IC32.7 IC40.7 SV63.8
N$706: IC32.8 IC40.8 SV63.9
N$707: IC32.9 IC40.9 SV63.10
N$708: IC32.10 IC40.10 SV63.11
N$709: IC32.11 IC40.11 SV63.12
N$710: IC32.12 IC40.12 SV63.13
N$711: IC32.13 IC40.13 SV64.1
N$712: IC32.14 IC40.14 SV64.2
N$713: IC32.15 IC40.15 SV64.3
N$714: IC32.16 IC40.16 SV64.4
N$715: IC32.17 IC40.17 SV64.5
N$716: IC32.18 IC40.18 SV64.6
N$717: IC32.19 IC40.19 SV64.7
N$718: IC32.20 IC40.20 SV64.8
N$719: IC32.21 IC40.21 SV64.9
N$720: IC32.22 IC40.22 SV64.10
N$721: IC32.23 IC40.23 SV64.11
N$722: IC32.24 IC40.24 SV64.12
N$725: IC33.1 IC41.1 SV65.2
N$726: IC33.2 IC41.2 SV65.3
N$727: IC33.3 IC41.3 SV65.4
N$728: IC33.4 IC41.4 SV65.5
N$729: IC33.5 IC41.5 SV65.6
N$730: IC33.6 IC41.6 SV65.7
N$731: IC33.7 IC41.7 SV65.8
N$732: IC33.8 IC41.8 SV65.9
N$733: IC33.9 IC41.9 SV65.10
N$734: IC33.10 IC41.10 SV65.11
N$735: IC33.11 IC41.11 SV65.12
N$736: IC33.12 IC41.12 SV65.13
N$737: IC33.13 IC41.13 SV66.1
N$738: IC33.14 IC41.14 SV66.2
N$739: IC33.15 IC41.15 SV66.3
N$740: IC33.16 IC41.16 SV66.4
N$741: IC33.17 IC41.17 SV66.5
N$742: IC33.18 IC41.18 SV66.6
N$743: IC33.19 IC41.19 SV66.7
N$744: IC33.20 IC41.20 SV66.8
N$745: IC33.21 IC41.21 SV66.9
N$746: IC33.22 IC41.22 SV66.10
N$747: IC33.23 IC41.23 SV66.11
N$748: IC33.24 IC41.24 SV66.12
N$751: IC34.1 IC42.1 SV67.2
N$752: IC34.2 IC42.2 SV67.3
N$753: IC34.3 IC42.3 SV67.4
N$754: IC34.4 IC42.4 SV67.5
N$755: IC34.5 IC42.5 SV67.6
N$756: IC34.6 IC42.6 SV67.7
N$757: IC34.7 IC42.7 SV67.8
N$758: IC34.8 IC42.8 SV67.9
N$759: IC34.9 IC42.9 SV67.10
N$760: IC34.10 IC42.10 SV67.11
N$761: IC34.11 IC42.11 SV67.12
N$762: IC34.12 IC42.12 SV67.13
N$763: IC34.13 IC42.13 SV68.1
N$764: IC34.14 IC42.14 SV68.2
N$765: IC34.15 IC42.15 SV68.3
N$766: IC34.16 IC42.16 SV68.4
N$767: IC34.17 IC42.17 SV68.5
N$768: IC34.18 IC42.18 SV68.6
N$769: IC34.19 IC42.19 SV68.7
N$770: IC34.20 IC42.20 SV68.8
N$771: IC34.21 IC42.21 SV68.9
N$772: IC34.22 IC42.22 SV68.10
N$773: IC34.23 IC42.23 SV68.11
N$774: IC34.24 IC42.24 SV68.12
N$777: IC35.1 IC43.1 SV69.2
N$778: IC35.2 IC43.2 SV69.3
N$779: IC35.3 IC43.3 SV69.4
N$780: IC35.4 IC43.4 SV69.5
N$781: IC35.5 IC43.5 SV69.6
N$782: IC35.6 IC43.6 SV69.7
N$783: IC35.7 IC43.7 SV69.8
N$784: IC35.8 IC43.8 SV69.9
N$785: IC35.9 IC43.9 SV69.10
N$786: IC35.10 IC43.10 SV69.11
N$787: IC35.11 IC43.11 SV69.12
N$788: IC35.12 IC43.12 SV69.13
N$789: IC35.13 IC43.13 SV70.1
N$790: IC35.14 IC43.14 SV70.2
N$791: IC35.15 IC43.15 SV70.3
N$792: IC35.16 IC43.16 SV70.4
N$793: IC35.17 IC43.17 SV70.5
N$794: IC35.18 IC43.18 SV70.6
N$795: IC35.19 IC43.19 SV70.7
N$796: IC35.20 IC43.20 SV70.8
N$797: IC35.21 IC43.21 SV70.9
N$798: IC35.22 IC43.22 SV70.10
N$799: IC35.23 IC43.23 SV70.11
N$800: IC35.24 IC43.24 SV70.12
N$803: IC36.1 IC44.1 SV71.2
N$804: IC36.2 IC44.2 SV71.3
N$805: IC36.3 IC44.3 SV71.4
N$806: IC36.4 IC44.4 SV71.5
N$807: IC36.5 IC44.5 SV71.6
N$808: IC36.6 IC44.6 SV71.7
N$809: IC36.7 IC44.7 SV71.8
N$810: IC36.8 IC44.8 SV71.9
N$811: IC36.9 IC44.9 SV71.10
N$812: IC36.10 IC44.10 SV71.11
N$813: IC36.11 IC44.11 SV71.12
N$814: IC36.12 IC44.12 SV71.13
N$815: IC36.13 IC44.13 SV72.1
N$816: IC36.14 IC44.14 SV72.2
N$817: IC36.15 IC44.15 SV72.3
N$818: IC36.16 IC44.16 SV72.4
N$819: IC36.17 IC44.17 SV72.5
N$820: IC36.18 IC44.18 SV72.6
N$821: IC36.19 IC44.19 SV72.7
N$822: IC36.20 IC44.20 SV72.8
N$823: IC36.21 IC44.21 SV72.9
N$824: IC36.22 IC44.22 SV72.10
N$825: IC36.23 IC44.23 SV72.11
N$826: IC36.24 IC44.24 SV72.12
N$829: IC37.1 IC45.1 SV73.2
N$830: IC37.2 IC45.2 SV73.3
N$831: IC37.3 IC45.3 SV73.4
N$832: IC37.4 IC45.4 SV73.5
N$833: IC37.5 IC45.5 SV73.6
N$834: IC37.6 IC45.6 SV73.7
N$835: IC37.7 IC45.7 SV73.8
N$836: IC37.8 IC45.8 SV73.9
N$837: IC37.9 IC45.9 SV73.10
N$838: IC37.10 IC45.10 SV73.11
N$839: IC37.11 IC45.11 SV73.12
N$840: IC37.12 IC45.12 SV73.13
N$841: IC37.13 IC45.13 SV74.1
N$842: IC37.14 IC45.14 SV74.2
N$843: IC37.15 IC45.15 SV74.3
N$844: IC37.16 IC45.16 SV74.4
N$845: IC37.17 IC45.17 SV74.5
N$846: IC37.18 IC45.18 SV74.6
N$847: IC37.19 IC45.19 SV74.7
N$848: IC37.20 IC45.20 SV74.8
N$849: IC37.21 IC45.21 SV74.9
N$850: IC37.22 IC45.22 SV74.10
N$851: IC37.23 IC45.23 SV74.11
N$852: IC37.24 IC45.24 SV74.12
N$855: IC38.1 IC46.1 SV75.2
N$856: IC38.2 IC46.2 SV75.3
N$857: IC38.3 IC46.3 SV75.4
N$858: IC38.4 IC46.4 SV75.5
N$859: IC38.5 IC46.5 SV75.6
N$860: IC38.6 IC46.6 SV75.7
N$861: IC38.7 IC46.7 SV75.8
N$862: IC38.8 IC46.8 SV75.9
N$863: IC38.9 IC46.9 SV75.10
N$864: IC38.10 IC46.10 SV75.11
N$865: IC38.11 IC46.11 SV75.12
N$866: IC38.12 IC46.12 SV75.13
N$867: IC38.13 IC46.13 SV76.1
N$868: IC38.14 IC46.14 SV76.2
N$869: IC38.15 IC46.15 SV76.3
N$870: IC38.16 IC46.16 SV76.4
N$871: IC38.17 IC46.17 SV76.5
N$872: IC38.18 IC46.18 SV76.6
N$873: IC38.19 IC46.19 SV76.7
N$874: IC38.20 IC46.20 SV76.8
N$875: IC38.21 IC46.21 SV76.9
N$876: IC38.22 IC46.22 SV76.10
N$877: IC38.23 IC46.23 SV76.11
N$878: IC38.24 IC46.24 SV76.12
VCC [supply]: C1.1 C2.1 C3.1 C4.1 C5.1 C6.1 C7.1 C8.1 C9.1 C10.1 C11.1 C12.1 C13.1 C14.1 C15.1 C16.1 C17.1 C18.1 C19.1 C20.1 C21.1 C22.1 C23.1 C24.1 C25.1 C26.1 C27.1 C28.1 C29.1 C30.1 C31.1 C32.1 C33.1 C34.1 C35.1 C36.1 C37.1 C38.1 C39.+ C40.+ SV2.9 SV4.9 SV6.9 SV8.9 SV10.9 SV12.9 SV14.9 SV16.9 SV18.9 SV20.9 SV22.9 SV24.9 SV26.9 SV28.9 SV30.9 SV32.9 SV34.9 SV36.9 SV38.9 SV40.9 SV42.9 SV44.9 SV46.9 SV48.9 SV50.9 SV52.9 SV54.9 SV56.9 SV58.9 SV60.9 SV62.13 SV64.13 SV66.13 SV68.13 SV70.13 SV72.13 SV74.13 SV76.13 U$1.AA2 U$1.BA2 U$1.CA2 U$1.DA2 U$2.A1 U$3.A1 U$4.A1 U$5.A1

## Library data of the parts
C1-C38 = rcl:C-US: CAPACITOR, American symbol
C39 C40 = rcl:CPOL-US: POLARIZED CAPACITOR, American symbol
IC1-IC30 = ic-package:DIL16: Dual In Line / Socket
IC31-IC46 = ic-package:DIL24: Dual In Line
SV1-SV60 = dec-con:MA09-1: Pin Header (.125" spacing)
SV61-SV76 = dec-con:MA13-1: Pin Header (.125" spacing)
U$1 = dec-con:QUAD: Quad-Height DEC board
U$2-U$5 = dec-con:THRU-HOLE2: Thru-Hole addition to double-sided edge connector.
U$8 = dec-con:OUTLINE-*: Board outlines for DEC boards.

## Net classes
0 default: width 0.508 mm
1 supply: width 0.762 mm